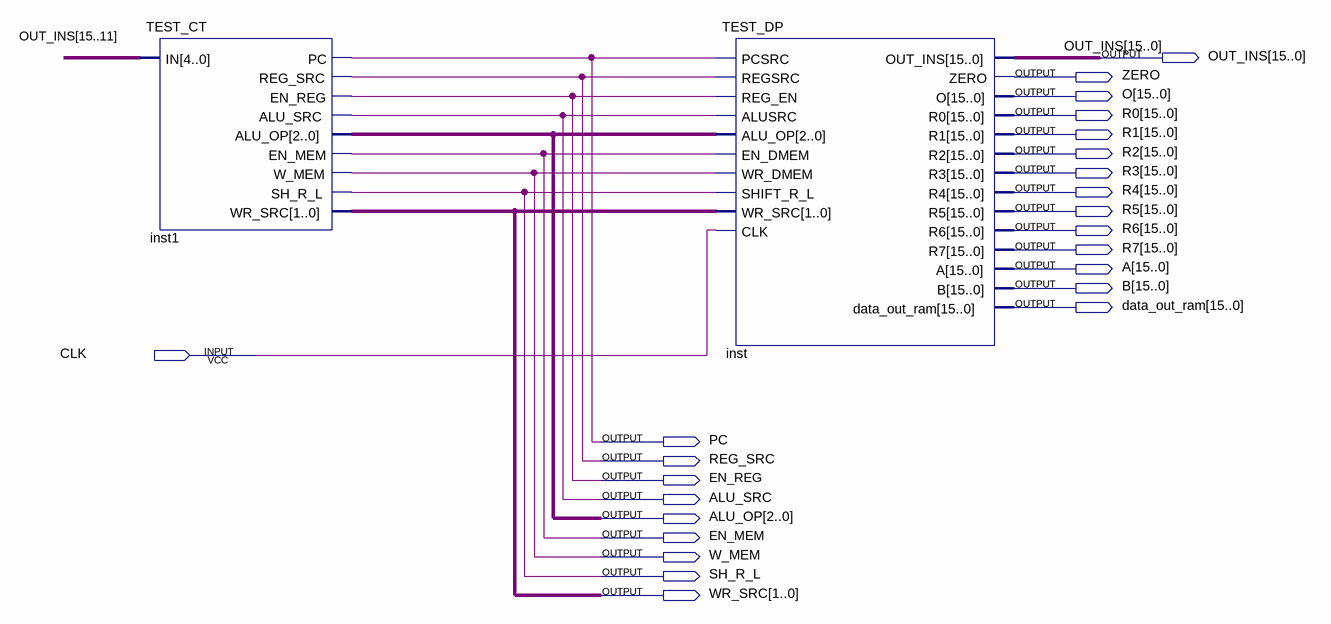
[diagram p0: schematic sheet]
// Quartus schematic TEST_RISC.bdf as structural Verilog: 2 symbols, 24 pins
module TEST_RISC (
  input  CLK,
  output [15:0] OUT_INS,
  output ZERO,
  output [15:0] O,
  output [15:0] R0,
  output [15:0] R1,
  output [15:0] R2,
  output [15:0] R3,
  output [15:0] R4,
  output [15:0] R5,
  output [15:0] R6,
  output [15:0] R7,
  output [15:0] A,
  output [15:0] B,
  output [15:0] data_out_ram,
  output PC,
  output REG_SRC,
  output EN_REG,
  output ALU_SRC,
  output [2:0] ALU_OP,
  output EN_MEM,
  output W_MEM,
  output SH_R_L,
  output [1:0] WR_SRC
);

  TEST_CT inst1 (
    .IN(OUT_INS[15:11]), .PC(PC), .REG_SRC(REG_SRC), .EN_REG(EN_REG), .ALU_SRC(ALU_SRC), .ALU_OP(ALU_OP),
    .EN_MEM(EN_MEM), .W_MEM(W_MEM), .SH_R_L(SH_R_L), .WR_SRC(WR_SRC));
  TEST_DP inst (
    .PCSRC(PC), .REGSRC(REG_SRC), .REG_EN(EN_REG), .ALUSRC(ALU_SRC), .ALU_OP(ALU_OP), .EN_DMEM(EN_MEM),
    .WR_DMEM(W_MEM), .SHIFT_R_L(SH_R_L), .WR_SRC(WR_SRC), .CLK(CLK), .OUT_INS(OUT_INS), .ZERO(ZERO), .O(O),
    .R0(R0), .R1(R1), .R2(R2), .R3(R3), .R4(R4), .R5(R5), .R6(R6), .R7(R7), .A(A), .B(B),
    .data_out_ram(data_out_ram));
endmodule
